# EAGLE design MO02 (EAGLE 6.3)
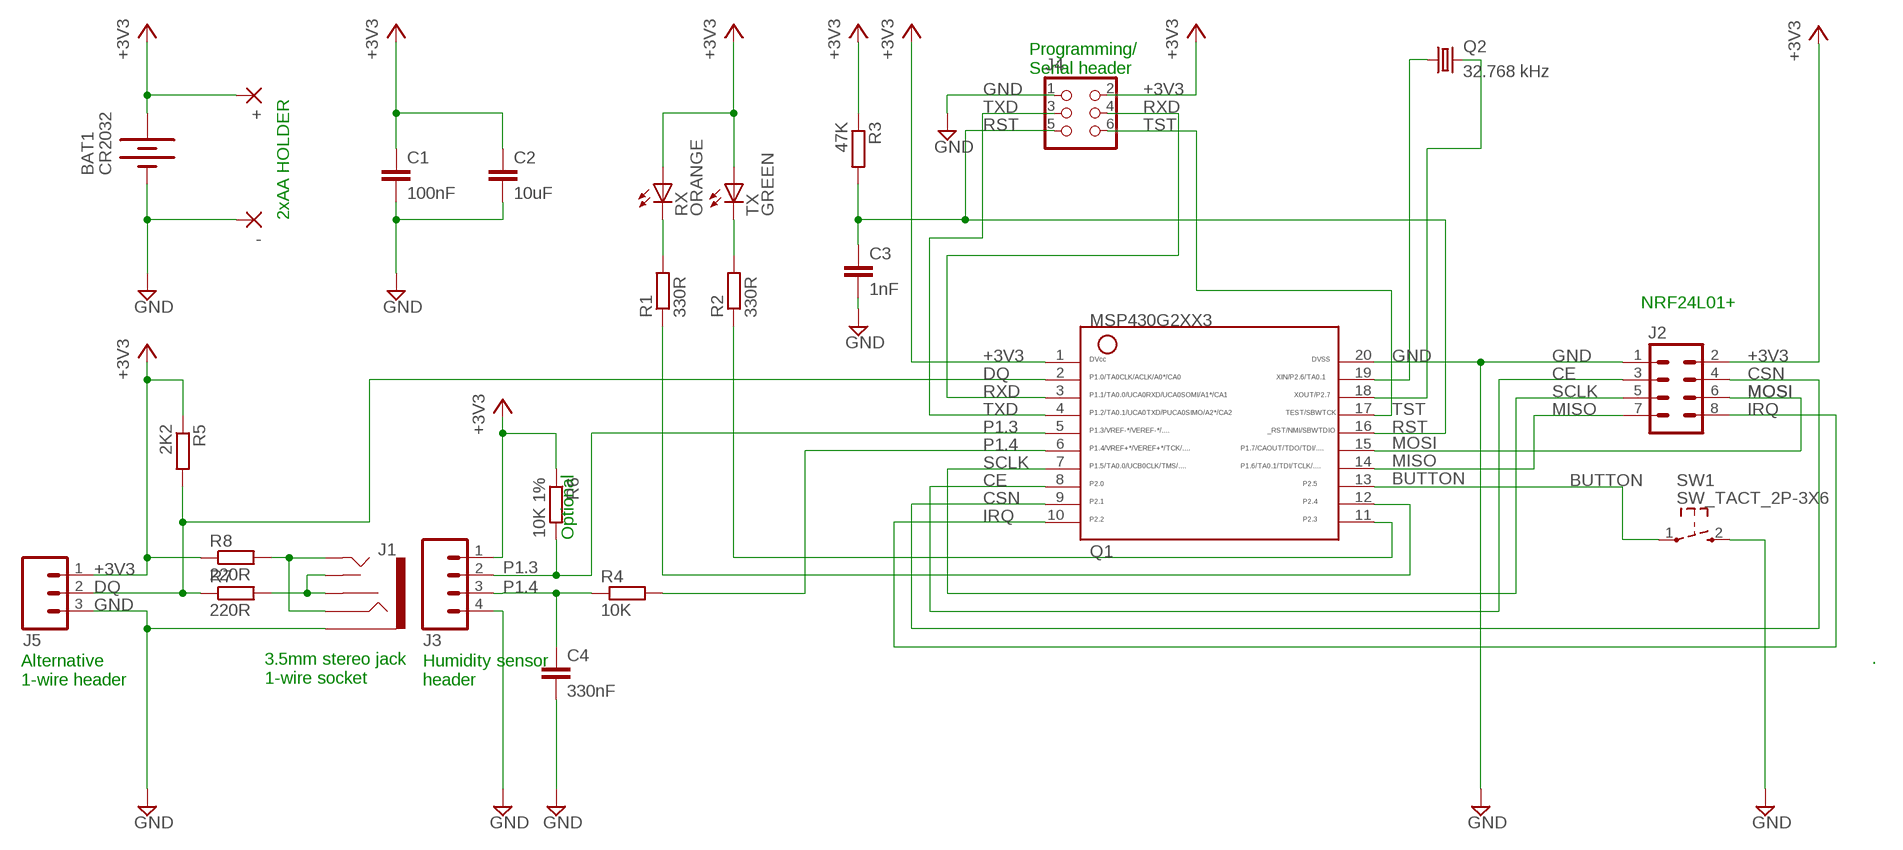
[diagram p0: schematic, sheet 1]

## Parts
+  2,54/1,0  [2,54/1,0]
-  2,54/1,0  [2,54/1,0]
BAT1  CR2032  BATTERY20PTH  [BATTCOM_20MM_PTH]
C1  100nF  C-EUC0805  [C0805]
C2  10uF  C-EUC1206  [C1206]
C3  1nF  C-EUC0805  [C0805]
C4  330nF  C-EUC0805  [C0805]
J1  AUDIO-JACK2PTH  [AUDIO-JACK]
J2  M04X2  [2X4]
J3  M04PTH  [1X04]
J4  CON_HEADER_2X03-PTH  [M2X3]
J5  M03PTH  [1X03]
Q1  G2XX3---PW20  [PW20]
Q2  32.768 kHz  CRYSTALTC26H  [TC26H]
R1  330R  R-EU_M0805  [M0805]
R2  330R  R-EU_M0805  [M0805]
R3  47K  R-EU_M0805  [M0805]
R4  10K  R-EU_M0805  [M0805]
R5  2K2  R-EU_M0805  [M0805]
R6  10K 1%  R-EU_M0805  [M0805]
R7  220R  R-EU_M0805  [M0805]
R8  220R  R-EU_M0805  [M0805]
RX  ORANGE  LEDCHIPLED_0805  [CHIPLED_0805]
SW1  SW_TACT_2P-3X6  [SW_TACT_3X6]
TX  GREEN  LEDCHIPLED_0805  [CHIPLED_0805]

## Nets
+3V3: +.1(P) BAT1.1(+) C1.1 C2.1 J2.2 J3.1 J4.2 J5.1 Q1.1 R3.1 R5.1 R6.1 R8.1 RX.A TX.A
BUTTON: Q1.13 SW1.1
CE: J2.3 Q1.8
CSN: J2.4 Q1.9
DQ: J5.2 Q1.2 R5.2 R7.1
GND: -.1(P) BAT1.2(-) C1.2 C2.2 C3.2 C4.2 J1.SLEEVE J2.1 J3.4 J4.1 J5.3 Q1.20 SW1.2
IRQ: J2.8 Q1.10
MISO: J2.7 Q1.14
MOSI: J2.6 Q1.15
N$1: R2.2 TX.C
N$2: R1.2 RX.C
N$3: Q1.11 R2.1
N$4: J1.RSH J1.TSH R7.2
N$5: Q1.12 R1.1
N$6: J1.RING J1.TIP R8.2
N$7: C4.1 J3.3 R4.1
P1.3: J3.2 Q1.5 R6.2
P1.4: Q1.6 R4.2
P2.6: Q1.19 Q2.1
P2.7: Q1.18 Q2.2
RST: C3.1 J4.5 Q1.16 R3.2
RXD: J4.4 Q1.3
SCLK: J2.5 Q1.7
TST: J4.6 Q1.17
TXD: J4.3 Q1.4

## Notes on the sheet
- Programming/
  Serial header
- 2xAA HOLDER
- NRF24L01+
- Optional
- .
- 3.5mm stereo jack
  1-wire socket
- Alternative
  1-wire header
- Humidity sensor 
  header

## Library data of the parts
+ - = wirepad:2,54/1,0: THROUGH-HOLE PAD
BAT1 = SparkFun:BATTERY: Battery Holders Various common sizes : AA, AAA, 20mm coin cell and 12mm coin cell.
C1 C3 C4 = resistor:C-EU: CAPACITOR, European symbol
C2 = rcl:C-EU: CAPACITOR, European symbol
J1 = SparkFun-Connectors:AUDIO-JACK2: Stereo audio jack with bypass switches.
J2 = SparkFun:M04X2
J3 = SparkFun:M04: Header 4 Standard 4-pin 0.1" header. Use with straight break away headers (SKU : PRT-00116), right angle break away headers (PRT-00553), swiss pins (PRT-00743), machine pins (PRT-00117), and female headers (PRT-00115). Molex polarized connector foot print use with SKU : PRT-08231 with associated crimp pins and housings. 1MM SMD Version SKU: PRT-10208
J4 = dp_devices:CON_HEADER_2X03
J5 = SparkFun:M03: Header 3 Standard 3-pin 0.1" header. Use with straight break away headers (SKU : PRT-00116), right angle break away headers (PRT-00553), swiss pins (PRT-00743), machine pins (PRT-00117), and female headers (PRT-00115). Molex polarized connector foot print use with SKU : PRT-08232 with associated crimp pins and housings.
Q1 = TI_MSP430_v16:G2XX3---PW20: MSP430G2XX1 TSSOP (PW) 20 Pin Package
Q2 = crystal:CRYSTAL: CRYSTAL; OC_FARNELL: unknown; OC_NEWARK: unknown
R1-R8 = resistor:R-EU_: RESISTOR, European symbol; RESISTANCE: 4K7
RX TX = led:LED: LED OSRAM: - CHIPLED LG R971, LG N971, LY N971, LG Q971, LY Q971, LO R971, LY R971 LH N974, LH R974 LS Q976, LO Q976, LY Q976 LO Q996 - Hyper CHIPLED LW Q18S LB Q993, LB Q99A, LB R99A - SideLED LS A670, LO A670, LY A670, LG A670, LP A670 LB A673, LV A673, LT A673, LW A673 LH A674 LY A675 LS A676, LA A676, LO A676, LY A676, LW A676 LS A679, LY A679, LG A679 - Hyper Micro SIDELED® LS Y876, LA Y876, LO Y876, LY Y876 LT Y87S - SmartLED LW L88C, LW L88S LB L89C, LB L89S, LG L890 LS L89K, LO L89K, LY L89K LS L896, LA L896, LO L896, LY L896 - TOPLED LS T670, LO T670, LY T670, LG T670, LP T670 LSG T670, LSP T670, LSY T670, LOP T670, LYG T670 LG T671, LOG T671, LSG T671 LB T673, LV T673, LT T673, LW T673 LH T674 LS T676, LA T676, LO T676, LY T676, LB T676, LH T676, LSB T676, LW T676 LB T67C, LV T67C, LT T67C, LS T67K, LO T67K, LY T67K, LW E67C LS E67B, LA E67B, LO E67B, LY E67B, LB E67C, LV E67C, LT E67C LW T67C LS T679, LY T679, LG T679 LS T770, LO T770, LY T770, LG T770, LP T770 LB T773, LV T773, LT T773, LW T773 LH T774 LS E675, LA E675, LY E675, LS T675 LS T776, LA T776, LO T776, LY T776, LB T776 LHGB T686 LT T68C, LB T68C - Hyper Mini TOPLED® LB M676 - Mini TOPLED Santana® LG M470 LS M47K, LO M47K, LY M47K Source: http://www.osram.convergy.de LUXEON: - LUMILED® LXK2-PW12-R00, LXK2-PW12-S00, LXK2-PW14-U00, LXK2-PW14-V00 LXK2-PM12-R00, LXK2-PM12-S00, LXK2-PM14-U00 LXK2-PE12-Q00, LXK2-PE12-R00, LXK2-PE12-S00, LXK2-PE14-T00, LXK2-PE14-U00 LXK2-PB12-K00, LXK2-PB12-L00, LXK2-PB12-M00, LXK2-PB14-N00, LXK2-PB14-P00, LXK2-PB14-Q00 LXK2-PR12-L00, LXK2-PR12-M00, LXK2-PR14-Q00, LXK2-PR14-R00 LXK2-PD12-Q00, LXK2-PD12-R00, LXK2-PD12-S00 LXK2-PH12-R00, LXK2-PH12-S00 LXK2-PL12-P00, LXK2-PL12-Q00, LXK2-PL12-R00 Source: www.luxeon.com KINGBRIGHT: KA-3528ASYC Source: www.kingbright.com
SW1 = dp_devices:SW_TACT_2P

## Board
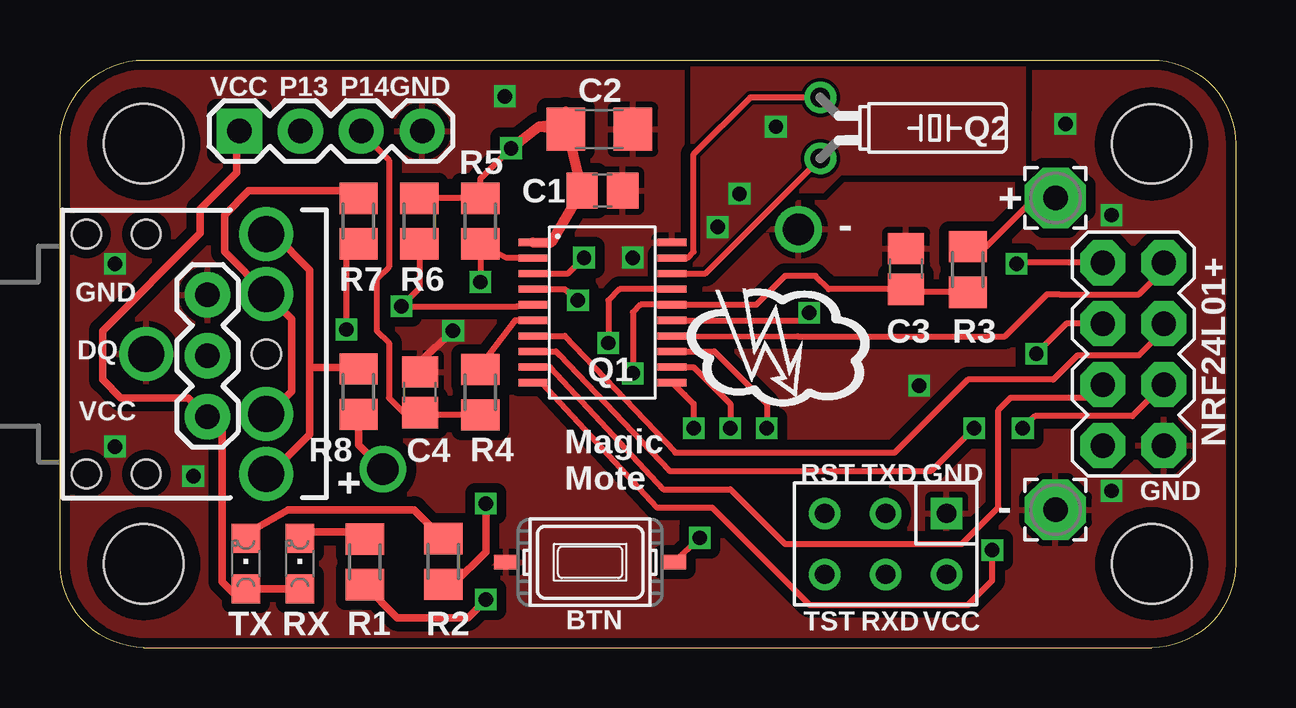
[diagram p1: board, top side]
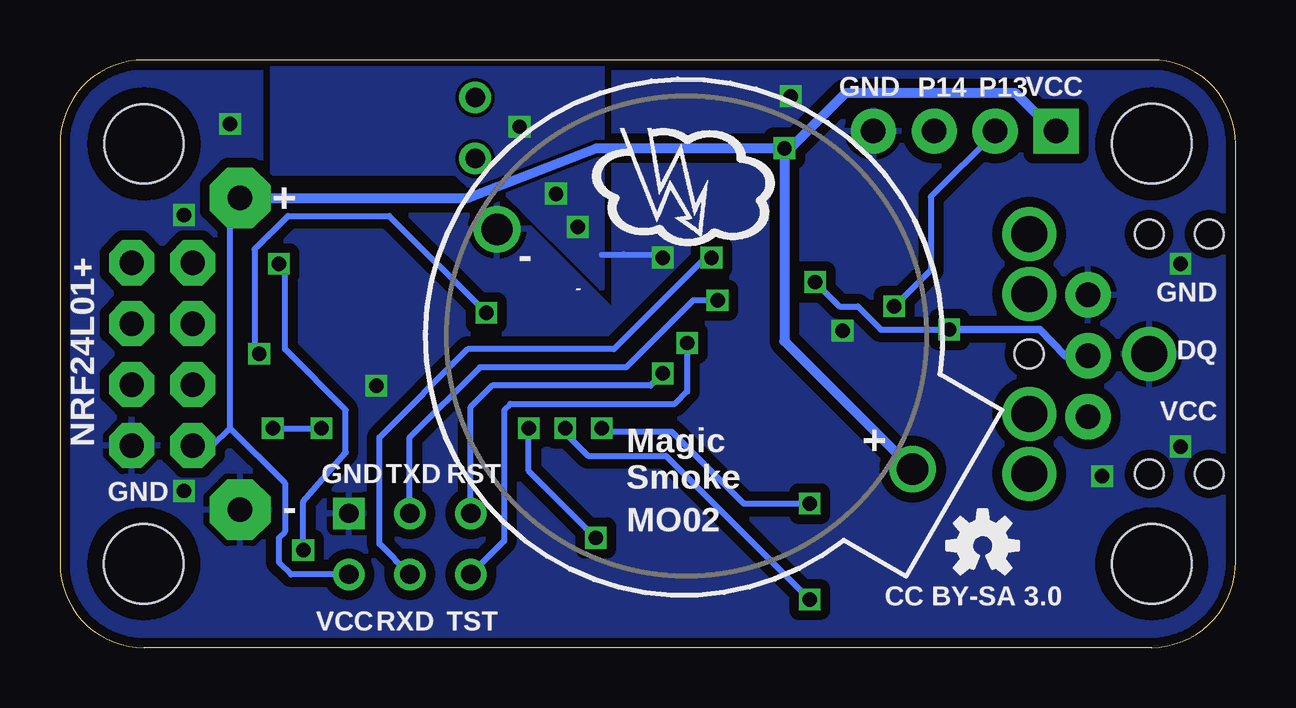
[diagram p2: board, bottom side, seen from below]

Size 49 x 24.5 mm. Coordinates in mm from the lower left corner, seen from the top.
Outline: 3.49,0 3.5,0
Outline: 3.5,0 45.5,0
Outline: 45.5,0 45.51,0
Outline: 0,3.49 0,3.6
Outline: 0,3.6 0,21
Outline: 0,21 0,21.01
Outline: 3.5,0 arc-90 0,3.6
Outline: 0,21 arc-90 3.5,24.5 45.5,24.5 arc-90 49,21 49,3.5 arc-90 45.5,0
Copper layers (1*16): Top 0.035mm / dielectric 1.5mm / Bottom 0.035mm
Design rules "Fusion_eagle_rule_v1.1": minimum track width 6mil, minimum drill 12mil, track to track 6mil, track to pad 6mil, pad to pad 6mil, via to via 6mil, smd to smd 0mil, copper to edge 10mil, drill to drill 10mil, minimum pad ring 10mil, minimum via ring 6mil, stop-mask expansion 2mil, vias tented up to drill 100mil, thermal gap 10mil

### Footprints (pad centres in the part's own frame; a part is rotated, then mirrored left to right if it is on the bottom)
2,54/1,0 = drill 1.016 pad 2.54 octagon: 1 0,0
BATTCOM_20MM_PTH = drill 1.3: 1 20,0; 2 0,0
C0805 = smd 1.3 x 1.5: 1 -0.85,0; 2 0.85,0
C1206 = smd 1.6 x 1.8: 1 -1.4,0; 2 1.4,0
AUDIO-JACK = drill 1.5 pad 2.184: RING 5,5; RSH 5,2.5; SLEEVE 0,0; TIP 5,-5; TSH 5,-2.5 | hole 1.2: 0,5; -2.5,5; -2.5,-5; 0,-5; 5,0
2X4 = drill 1.016 pad 1.88 octagon: 1 -3.81,-1.27; 2 -3.81,1.27; 3 -1.27,-1.27; 4 -1.27,1.27; 5 1.27,-1.27; 6 1.27,1.27; 7 3.81,-1.27; 8 3.81,1.27
1X04 = drill 1.016 pad 1.88 square: 1 0,0 | drill 1.016 pad 1.88: 2 2.54,0; 3 5.08,0; 4 7.62,0
M2X3 = drill 0.8 square: 1 -2.54,-1.27 | drill 0.8: 2 -2.54,1.27; 3 0,-1.27; 4 0,1.27; 5 2.54,-1.27; 6 2.54,1.27
1X03 = drill 1.016 pad 1.88: 1 0,0; 2 2.54,0; 3 5.08,0
PW20 = smd 0.3 x 1.2: 1 -2.925,-2.9; 2 -2.275,-2.9; 3 -1.625,-2.9; 4 -0.975,-2.9; 5 -0.325,-2.9; 6 0.325,-2.9; 7 0.975,-2.9; 8 1.625,-2.9; 9 2.275,-2.9; 10 2.925,-2.9; 11 2.925,2.9; 12 2.275,2.9; 13 1.625,2.9; 14 0.975,2.9; 15 0.325,2.9; 16 -0.325,2.9; 17 -0.975,2.9; 18 -1.625,2.9; 19 -2.275,2.9; 20 -2.925,2.9
TC26H = drill 0.813: 1 -1.27,0; 2 1.27,0
M0805 = smd 1.3 x 1.6: 1 -0.95,0; 2 0.95,0
CHIPLED_0805 = smd 1.2 x 1.2: A 0,-1.05; C 0,1.05
SW_TACT_3X6 = smd 1 x 0.6: 1 -3.5,0; 2 3.5,0
STAND-OFF = hole 3.302: 0,0

### Placement (x,y rotation side)
+  41.5,18.75 0 top
-  41.5,5.75 0 top
BAT1  30.78,17.44 330 bottom
C1  22.61,19.05 0 top
C2  22.48,21.61 0 top
C3  35.26,15.79 90 top
C4  15,10.64 90 top
J1  3.6,12.24 0 top
J2  44.74,12.23 90 top
J3  7.48,21.54 0 top
J4  34.42,4.32 180 top
J5  6.15,9.63 90 top
Q1  22.61,13.97 270 top
Q2  31.7,21.66 270 top
R1  12.71,3.57 90 top
R2  15.97,3.59 90 top
R3  37.84,15.77 270 top
R4  17.53,10.64 90 top
R5  17.53,17.78 270 top
R6  14.99,17.78 270 top
R7  12.45,17.78 90 top
R8  12.45,10.67 90 top
RX  10,3.5 0 top
SW1  22.1,3.56 180 top
TX  7.75,3.5 0 top
U$1  [OSHW-LOGO-S]  10.54,4.25 0 bottom
U$2  [STAND-OFF]  45.51,3.49 0 top
U$3  [STAND-OFF]  3.49,3.49 0 top
U$4  [STAND-OFF]  3.49,21.01 0 top
U$5  [STAND-OFF]  45.5,21 0 top

### Tracks (layer width: path | path; a pad name or v marks a point on that pad's centre or on a via)
+3V3  (via drill 0.6)
  Top 0.254: R6.1 R5.1 17.53,19.54 v18.8,20.82 | R3.1 38.6,16.71 40.64,18.75 +.1
  Top 0.305: RX.A TX.A 7.71,2.7 7.3,2.2 6.75,2.75 6.75,9.02 J5.1 6.12,9.63 5.33,10.41 2.54,10.41 1.78,11.18 1.78,13.21 5.84,17.27 5.84,18.29 7.37,19.81 7.37,21.42 J3.1 | R8.1 12.45,8.45 BAT1.1
  Top 0.406: 21.09,21.84 19.94,21.71 | 19.94,21.71 C2.1 21.15,21.61 | Q1.1 20.48,16.89 C1.1 21.15,21.61 | 21.08,22.35 21.14,22.16 21.14,21.61 21.15,21.61 | v18.8,20.82 19.94,21.71
  Bottom 0.254: J2.2 42.63,8.42 41.91,9.14 | 41.91,9.14 41.91,18.34 +.1 | 41.91,9.14 39.62,6.86 39.62,4.83 39.88,4.57 39.88,3.56 39.37,3.05 J4.2
  Bottom 0.406: J3.1 7.58,21.54 9.15,23.11 16.26,23.11 18.55,20.82 v18.8,20.82 | v18.8,20.82 26.64,20.82 32.01,18.75 +.1 | v18.8,20.82 18.8,12.78 BAT1.1
BUTTON  (via drill 0.6)
  Top 0.254: Q1.13 27.28,12.35 29.46,10.16 v29.46,9.14 | SW1.1 v26.67,4.57
  Bottom 0.254: v26.67,4.57 29.46,7.37 v29.46,9.14
CE  (via drill 0.6)
  Top 0.254: J2.3 44.7,9.65 40.64,9.65 v40.13,9.14 | Q1.8 20.68,12.35 20.83,12.19 25.4,7.37 36.32,7.37 v38.1,9.14
  Bottom 0.254: v40.13,9.14 v38.1,9.14
CSN
  Top 0.254: Q1.9 20.44,11.7 25.15,6.6 27.94,6.6 30.23,4.32 37.59,4.32 39.12,5.84 39.12,9.91 39.62,10.41 42.93,10.41 J2.4
DQ  (via drill 0.6)
  Top 0.254: Q1.2 18.62,16.25 R5.2 v17.53,15.24 | v11.94,13.26 11.94,16.26 12.7,17.02 12.7,16.83 R7.1
  Bottom 0.254: v17.53,15.24 16.51,14.22 15.75,14.22 14.78,13.26 v11.94,13.26
  Bottom 0.305: J5.2 7.09,12.17 8.15,13.26 v11.94,13.26
GND  (via drill 0.6)
  Top 0.254: C4.2 15,11.92
  Top 0.305: 15,11.92 v16.38,13.21
  Bottom 0.254: 26.42,16.38 25.51,16.38 25.51,16.39 | 25.51,16.39 25.51,16.4 25.27,16.38 24,16.38 | 25.51,16.39 24.01,16.39 24,16.38 | 24,16.38 v23.88,16.26
  other vias: 2.29,8.38 2.29,16 27.42,17.53 28.32,18.92 35.81,10.92 41.91,21.83 43.83,18.03 18.54,22.99 5.56,7.14 43.83,6.53 29.84,21.72
  pour Top (isolate 0.406): 51.05,25.41 51.05,-1.02 -1.02,-1.02 -1.02,25.4 25.91,25.4 25.91,13.97 30.48,18.54 32,18.54 32.77,19.3 40.64,19.3 40.65,25.41
  pour Bottom (isolate 0.406): -0.51,24.89 25.91,24.89 25.91,13.97 30.48,18.54 32,18.54 32.77,19.3 40.64,19.3 40.64,24.89 50.55,24.89 50.55,-0.51 -0.51,-0.51
  pour Bottom: 26.42,24.89 40.13,24.89 40.13,19.81 32.51,19.81 31.75,19.05 30.48,19.05 26.42,14.99
  pour Top: 26.42,25.4 40.13,25.4 40.13,19.81 32.51,19.81 31.75,19.05 30.48,19.05 26.42,14.99
IRQ  (via drill 0.6)
  Top 0.254: Q1.10 20.09,11.03 24.89,5.84 27.18,5.84 31.24,1.78 37.85,1.78 38.86,2.79 v38.86,4.06 | J2.8 39.92,16.04 v39.88,16
  Bottom 0.254: v38.86,4.06 38.86,6.1 37.08,8.13 37.08,9.91 39.62,12.45 39.62,15.75 v39.88,16
MISO
  Top 0.254: J2.7 46.01,15.77 44.97,14.73 41.65,14.73 41.64,14.73 41.15,14.73 39.39,12.97 30.75,12.97 25.95,12.99 Q1.14
MOSI  (via drill 0.6)
  Top 0.254: J2.6 41.95,13.5 v40.7,12.25 | Q1.15 30.92,13.64 v31.23,13.95
  Bottom 0.254: v40.7,12.25 40.89,12.45 40.89,16.61 39.5,18 35.27,18 v31.23,13.95
N$1
  Top 0.305: TX.C 7.75,4.75 9.5,5.75 14.76,5.75 R2.2
N$2
  Top 0.305: RX.C 10.58,4.83 12.88,4.83 R1.2
N$3  (via drill 0.6)
  Top 0.254: Q1.11 26.04,10.54 26.42,10.16 v26.42,9.14
  Top 0.305: 15.89,2.64 R2.1 16.39,2.64 17.75,4 v17.75,6
  Bottom 0.254: v17.75,6 20.5,6 23.5,9 26.27,9 v26.42,9.14
N$4
  Top 0.305: J1.TSH 8.72,9.74 9.65,10.67 9.65,13.69 J1.RSH 8.6,14.77 6.86,16.51 6.86,18.03 7.87,19.05 12.13,19.05 R7.2
N$5  (via drill 0.6)
  Top 0.254: 13.17,2.55 R1.1 | Q1.12 26.41,11.7 27.94,10.16 v27.94,9.14
  Top 0.305: R1.1 14.05,1.25 17,1.25 v17.75,2
  Bottom 0.254: v17.75,2 23.75,8 27,8 27.94,8.94 v27.94,9.14
N$6
  Top 0.305: J1.TIP 8.76,7.24 10.41,8.89 10.41,11.68 | R8.2 12.38,11.68 10.41,11.68 | J1.RING 8.92,17.24 10.41,15.75 10.41,11.68
N$7
  Top 0.254: R4.1 15.1,9.69 C4.1 14.86,9.65 14.48,9.65 13.72,10.41 13.72,12.7 13.21,13.21 13.21,15.37 13.72,15.88 13.72,20.32 12.56,21.48 J3.3
P1.3  (via drill 0.6)
  Top 0.254: R6.2 14.99,14.99 v14.22,14.22 19.05,14.22 19.23,14.29 Q1.5
  Bottom 0.254: J3.2 10.02,21.48 12.7,18.8 12.7,15.75 v14.22,14.22
P1.4
  Top 0.254: Q1.6 18.98,13.64 17.27,11.43 R4.2
P2.6
  Top 0.254: Q1.19 26.15,16.25 26.42,16.51 26.42,20.57 28.77,22.93 Q2.1
P2.7
  Top 0.254: Q1.18 26.9,15.6 Q2.2
RST  (via drill 0.6)
  Top 0.254: v23.88,11.43 23.88,13.97 24.2,14.29 Q1.16 29.03,14.29 30.23,15.49 31.5,15.49 32.05,14.94 C3.1 35.39,14.81 R3.2
  Bottom 0.254: v23.88,11.43 24.38,10.92 30.99,10.92 31.88,10.03 J4.5
RXD  (via drill 0.6)
  Top 0.254: Q1.3 21.18,15.6 v21.84,16.26
  Bottom 0.254: v21.84,16.26 22.1,16.26 25.91,12.45 32,12.45 35.69,8.76 35.69,4.32 J4.4
SCLK
  Top 0.254: J2.5 46.01,13.23 44.97,12.19 42.43,12.19 41.4,11.18 37.85,11.18 34.8,8.13 25.65,8.13 21.04,12.99 Q1.7
TST  (via drill 0.6)
  Top 0.254: Q1.17 23.33,14.95 22.86,14.48 v22.86,12.7
  Bottom 0.254: v22.86,12.7 22.86,10.67 23.37,10.16 30.23,10.16 30.48,9.91 30.48,4.45 J4.6
TXD  (via drill 0.6)
  Top 0.254: Q1.4 21.04,14.95 v21.59,14.48
  Bottom 0.254: v21.59,14.48 22.61,14.48 25.4,11.68 31.5,11.68 34.42,8.76 J4.3

### Text on the board
tPlace: Magic / Mote
bPlace: Magic / Smoke | MO02 | CC BY-SA 3.0
tNames: VCC | P13 | P14 | GND | - | NRF24L01+ | GND | DQ | VCC | + | RST | TXD | GND | GND | TST | RXD | VCC | BTN
bNames: VCC | P13 | P14 | GND | + | - | NRF24L01+ | GND | DQ | VCC | + | RST | TXD | GND | - | GND | TST | RXD | VCC